# Altium schematic sheet Auxiliary.SchDoc: Relays & auxiliary circuits
size A4; CheckedBy: Fellipe; Author: Hildo Guillardi Júnior; Organization: UNICAMP / LCEE; Address1: University of Campinas - Brazil; Address2: Power Conditioning Laboratory; Address3: Licensed by GNU GPL 3.0; ProjectName: Easy Inverter
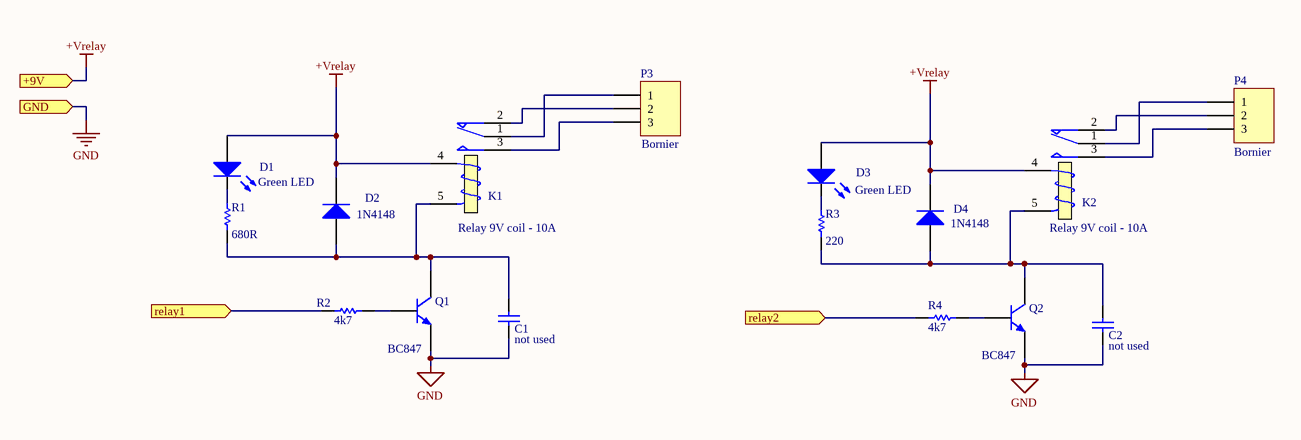
[diagram p0: Auxiliary.SchDoc]

## Parts
C1  value not used  [0805_W]
C2  value not used  [0805_W]
D1  value Green LED  [LED_0805]
D2  value 1N4148  [SOD-123]
D3  value Green LED  [LED_0805]
D4  value 1N4148  [SOD-123]
K1  value Relay 9V coil - 10A  [Relay - SPDT]
K2  value Relay 9V coil - 10A  [Relay - SPDT]
P3  value Bornier  [KK-3_G]
P4  value Bornier  [KK-3_G]
Q1  value BC847  [SOT-23-TT3_L]
Q2  value BC847  [SOT-23-TT3_L]
R1  value 680R  [0805_W]
R2  value 4k7  [0805_W]
R3  value 220  [0805_W]
R4  value 4k7  [0805_W]

## Ports
+9V (in), GND (in), relay1 (in), relay2 (in)

## Nets
+Vrelay: D1.1(A) D2.2(K) D3.1(A) D4.2(K) K1.4(T1) K2.4(T1) ; port +9V
GND: C1.1 C2.1 Q1.2(E) Q2.2(E) ; port GND
relay1: R2.1 ; port relay1
relay2: R4.1 ; port relay2
NetC1_2: C1.2 D2.1(A) K1.5(T2) Q1.3(C) R1.2
NetC2_2: C2.2 D4.1(A) K2.5(T2) Q2.3(C) R3.2
NetD1_2: D1.2(K) R1.1
NetD3_2: D3.2(K) R3.1
NetK1_1: K1.1(COM) P3.1
NetK1_2: K1.2(NC) P3.2
NetK1_3: K1.3(NO) P3.3
NetK2_1: K2.1(COM) P4.1
NetK2_2: K2.2(NC) P4.2
NetK2_3: K2.3(NO) P4.3
NetQ1_1: Q1.1(B) R2.2
NetQ2_1: Q2.1(B) R4.2

## Notes on the sheet
- Title
- Author
- Revisor
- Hildo G Jr
- Revision:
- Sheet
- of
- File:
- Size:
- A4
- HGJr

## Library data of the parts
C1 C2 = Cap: Capacitor
D1 D3 = LED0: Typical INFRARED GaAs LED; pn: SML-LXR85GC-TR
D2 D4 = Diode 1N4148: High Conductance Fast Diode; pn: 1N4148W-TP
K1 K2 = Relay: SPDT Relay; pn: G5LE-14-DC9
P3 P4 = Header 3: Header, 3-Pin; pn: 1935174
Q1 Q2 = BC847: NPN General-purpose Transistor; pn: BC847BLT1G
R1 R3 = Res_0805: Resistor; pn: RMCF0805JT680R
R2 R4 = Res1: Resistor; pn: RMCF0805JT4K70